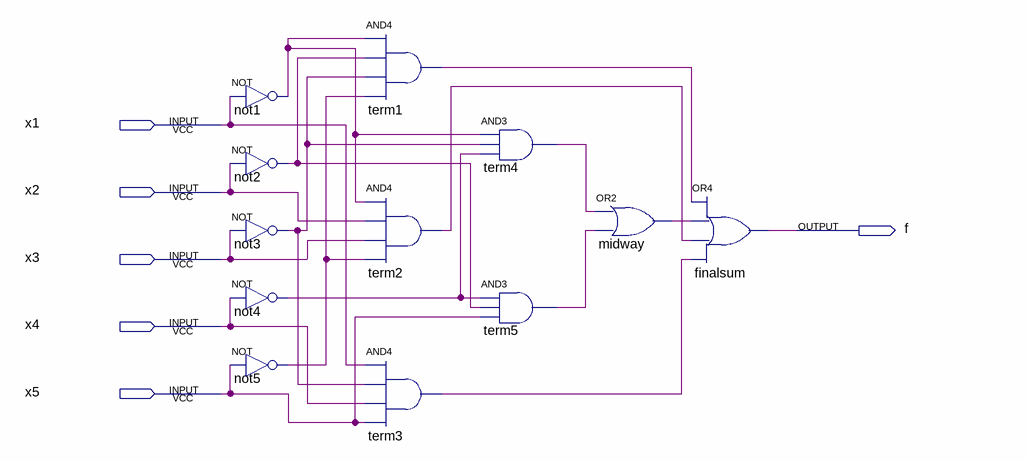
[diagram p0: schematic sheet]
// Quartus schematic q3.bdf as structural Verilog: 12 symbols, 6 pins
module q3 (
  input  x1,
  input  x2,
  input  x3,
  input  x4,
  input  x5,
  output f
);

  wire midway_out, not1_out, not2_out, not3_out, not4_out, not5_out, term1_out, term2_out, term3_out,
       term4_out, term5_out;

  not not1 (not1_out, x1);
  not not2 (not2_out, x2);
  not not3 (not3_out, x3);
  not not4 (not4_out, x4);
  not not5 (not5_out, x5);
  and term1 (term1_out, not1_out, not2_out, not3_out, not5_out);
  and term2 (term2_out, not1_out, x2, x3, not5_out);
  and term3 (term3_out, x1, not3_out, x4, x5);
  and term4 (term4_out, not1_out, not3_out, not4_out);
  and term5 (term5_out, not4_out, not2_out, x5);
  or midway (midway_out, term4_out, term5_out);
  or finalsum (f, term1_out, midway_out, term2_out, term3_out);
endmodule
